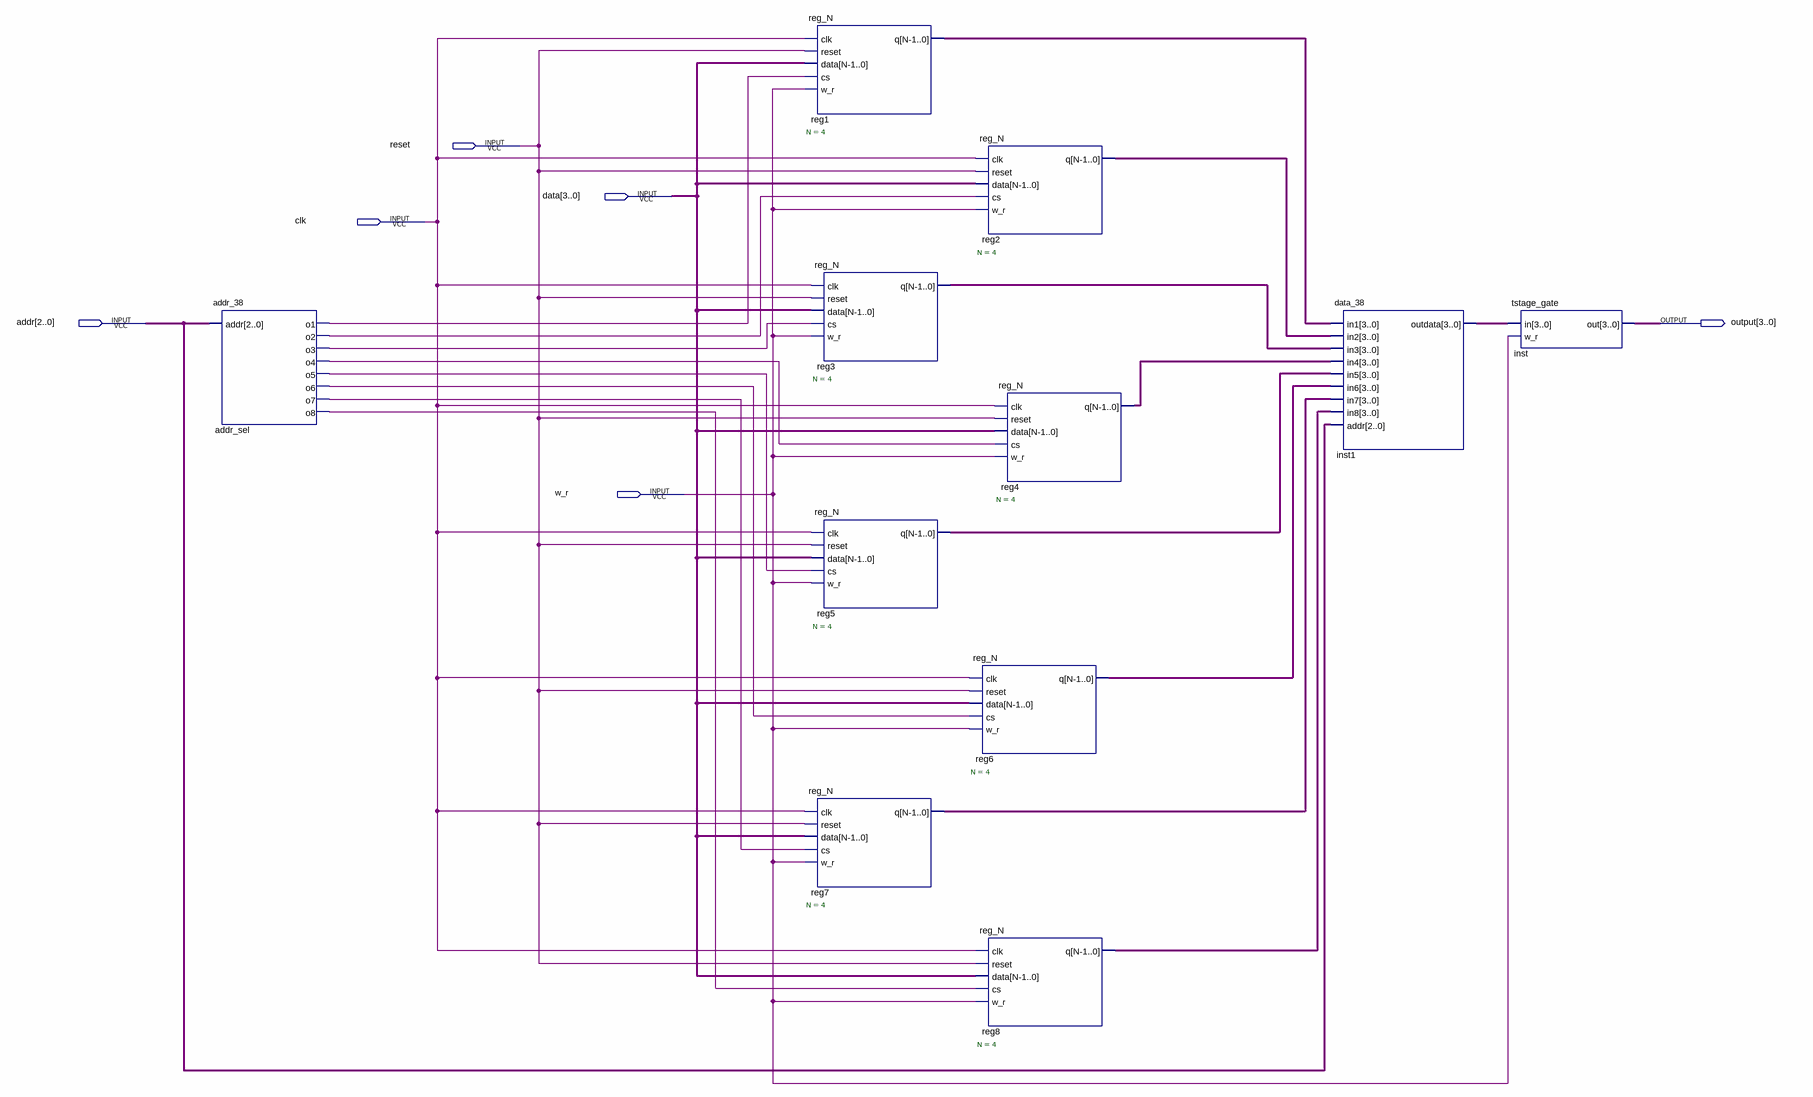
[diagram p0: schematic sheet]
// Quartus schematic reg_files.bdf as structural Verilog: 11 symbols, 6 pins
module reg_files (
  input  reset,
  input  [3:0] data,
  input  clk,
  input  [2:0] addr,
  input  w_r,
  output [3:0] \output 
);

  wire addr_sel_o1, addr_sel_o2, addr_sel_o3, addr_sel_o4, addr_sel_o5, addr_sel_o6, addr_sel_o7, addr_sel_o8;
  wire [3:0] inst1_outdata, reg1_q, reg2_q, reg3_q, reg4_q, reg5_q, reg6_q, reg7_q, reg8_q;

  addr_38 addr_sel (
    .addr(addr), .o1(addr_sel_o1), .o2(addr_sel_o2), .o3(addr_sel_o3), .o4(addr_sel_o4), .o5(addr_sel_o5),
    .o6(addr_sel_o6), .o7(addr_sel_o7), .o8(addr_sel_o8));
  reg_N #(.N(4)) reg1 (.clk(clk), .reset(reset), .data(data), .cs(addr_sel_o1), .w_r(w_r), .q(reg1_q));
  reg_N #(.N(4)) reg3 (.clk(clk), .reset(reset), .data(data), .cs(addr_sel_o3), .w_r(w_r), .q(reg3_q));
  reg_N #(.N(4)) reg5 (.clk(clk), .reset(reset), .data(data), .cs(addr_sel_o5), .w_r(w_r), .q(reg5_q));
  reg_N #(.N(4)) reg7 (.clk(clk), .reset(reset), .data(data), .cs(addr_sel_o7), .w_r(w_r), .q(reg7_q));
  reg_N #(.N(4)) reg2 (.clk(clk), .reset(reset), .data(data), .cs(addr_sel_o2), .w_r(w_r), .q(reg2_q));
  reg_N #(.N(4)) reg6 (.clk(clk), .reset(reset), .data(data), .cs(addr_sel_o6), .w_r(w_r), .q(reg6_q));
  reg_N #(.N(4)) reg8 (.clk(clk), .reset(reset), .data(data), .cs(addr_sel_o8), .w_r(w_r), .q(reg8_q));
  reg_N #(.N(4)) reg4 (.clk(clk), .reset(reset), .data(data), .cs(addr_sel_o4), .w_r(w_r), .q(reg4_q));
  data_38 inst1 (
    .in1(reg1_q), .in2(reg2_q), .in3(reg3_q), .in4(reg4_q), .in5(reg5_q), .in6(reg6_q), .in7(reg7_q),
    .in8(reg8_q), .addr(addr), .outdata(inst1_outdata));
  tstage_gate inst (.in(inst1_outdata), .w_r(w_r), .out(\output ));
endmodule
